# EAGLE design siedle-switch (EAGLE 6.5.0)
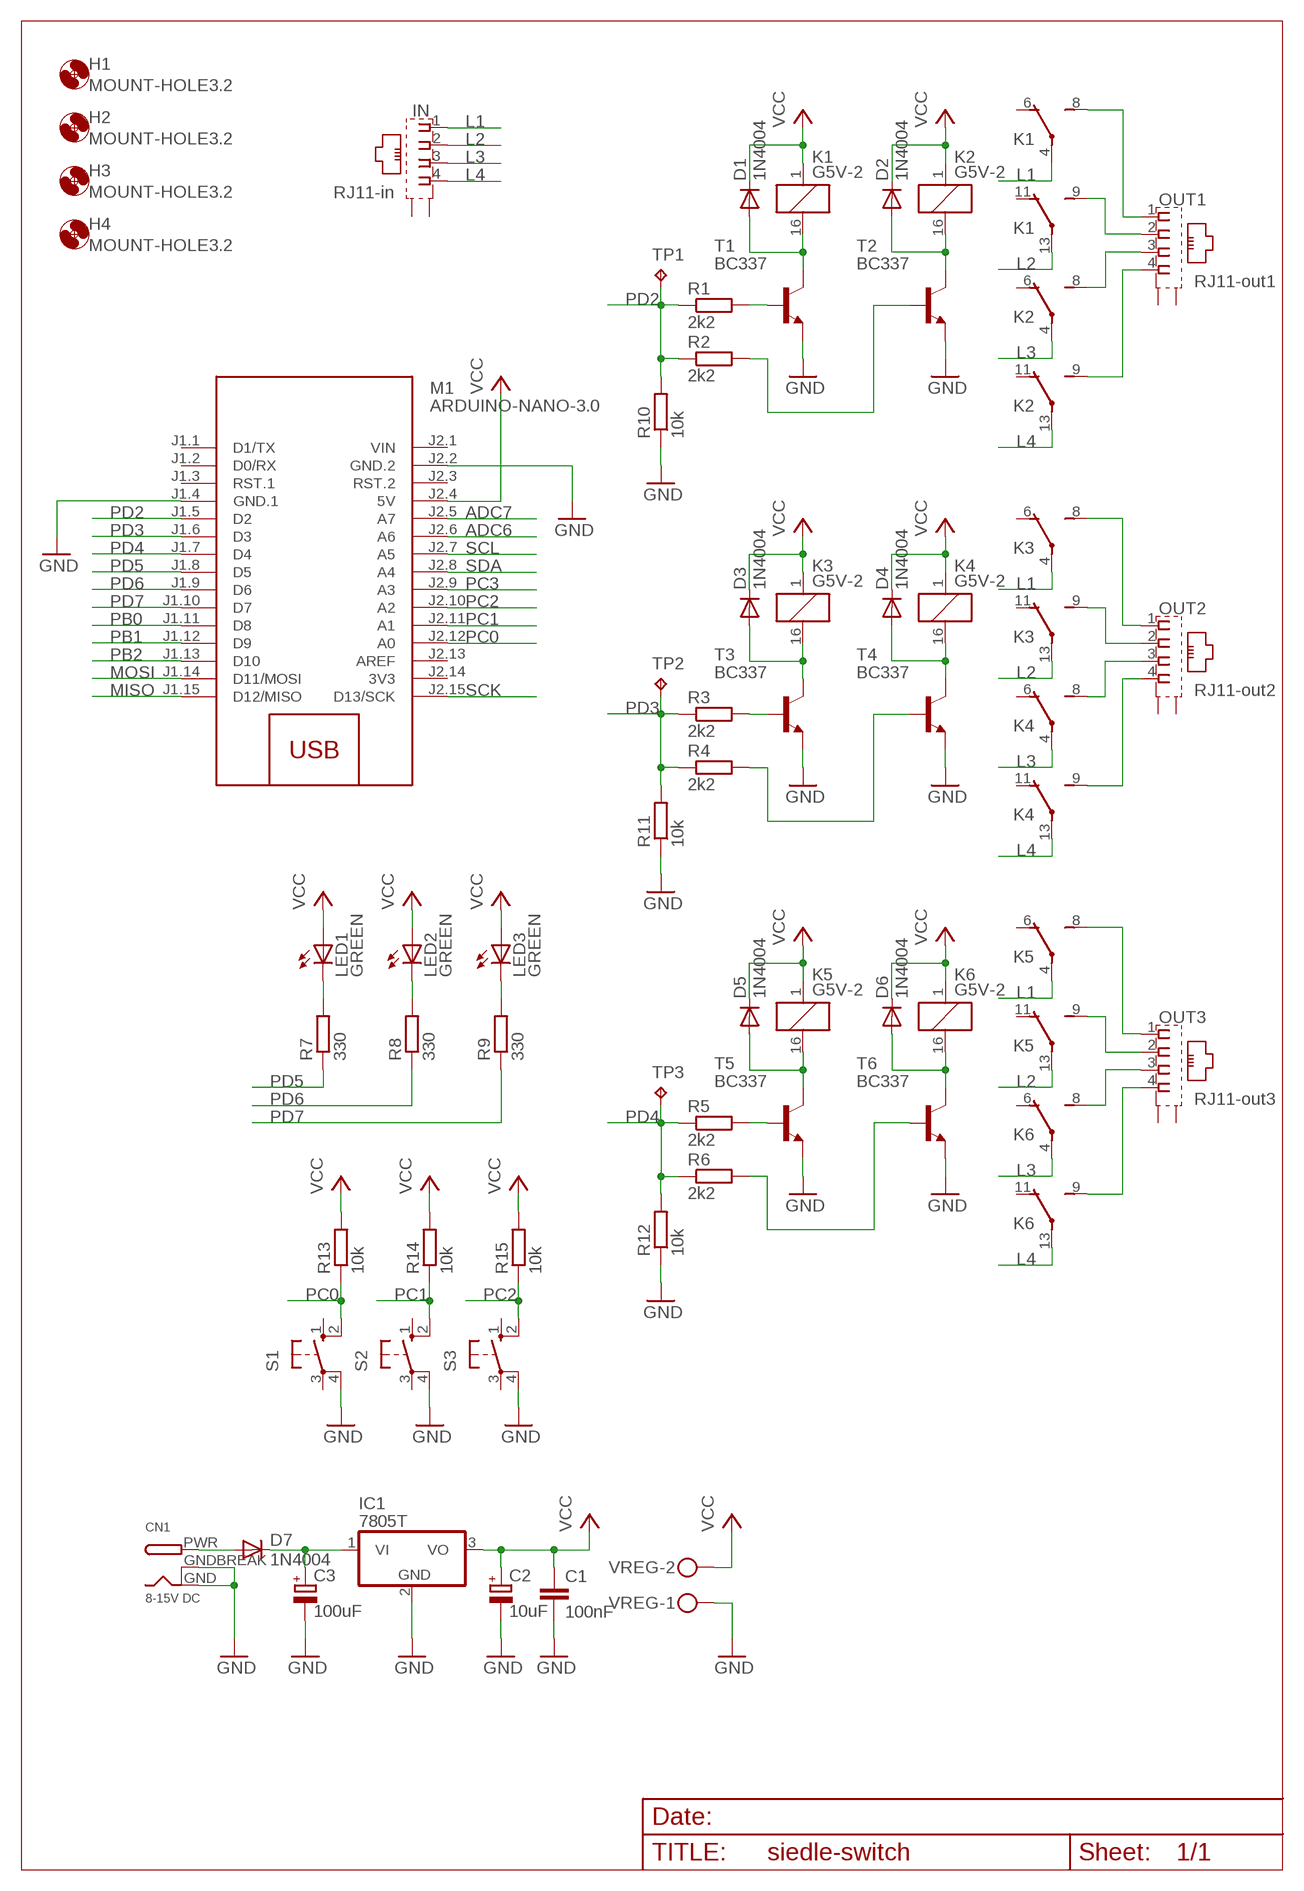
[diagram p0: schematic, sheet 1]

## Parts
C1  100nF  C-EUC1206  [C1206]
C2  10uF  CPOL-EUE2.5-5  [E2,5-5]
C3  100uF  CPOL-EUE3.5-8  [E3,5-8]
CN1  8-15V DC  DCBARRELPTH  [DCJACK_2MM_PTH]
D1  1N4004  [DO41-10]
D2  1N4004  [DO41-10]
D3  1N4004  [DO41-10]
D4  1N4004  [DO41-10]
D5  1N4004  [DO41-10]
D6  1N4004  [DO41-10]
D7  1N4004  [DO41-10]
H1  MOUNT-HOLE3.2  [3,2]
H2  MOUNT-HOLE3.2  [3,2]
H3  MOUNT-HOLE3.2  [3,2]
H4  MOUNT-HOLE3.2  [3,2]
IC1  7805T  [TO220H]
IN  RJ11-in  XRJK-S-01-6-4-0-9M2  [XRJK-S-01-6-4-0-9M2]
K1  G5V-2  [G5V-2]
K2  G5V-2  [G5V-2]
K3  G5V-2  [G5V-2]
K4  G5V-2  [G5V-2]
K5  G5V-2  [G5V-2]
K6  G5V-2  [G5V-2]
LED1  GREEN  LED3MM  [LED3MM]
LED2  GREEN  LED3MM  [LED3MM]
LED3  GREEN  LED3MM  [LED3MM]
M1  ARDUINO-NANO-3.0  [ARDUINO-NANO-3.0]
OUT1  RJ11-out1  XRJK-S-01-6-4-0-9M2  [XRJK-S-01-6-4-0-9M2]
OUT2  RJ11-out2  XRJK-S-01-6-4-0-9M2  [XRJK-S-01-6-4-0-9M2]
OUT3  RJ11-out3  XRJK-S-01-6-4-0-9M2  [XRJK-S-01-6-4-0-9M2]
R1  2k2  R-EU_0309/10  [0309/10]
R2  2k2  R-EU_0309/10  [0309/10]
R3  2k2  R-EU_0309/10  [0309/10]
R4  2k2  R-EU_0309/10  [0309/10]
R5  2k2  R-EU_0309/10  [0309/10]
R6  2k2  R-EU_0309/10  [0309/10]
R7  330  R-EU_0309/10  [0309/10]
R8  330  R-EU_0309/10  [0309/10]
R9  330  R-EU_0309/10  [0309/10]
R10  10k  R-EU_0309/10  [0309/10]
R11  10k  R-EU_0309/10  [0309/10]
R12  10k  R-EU_0309/10  [0309/10]
R13  10k  R-EU_0309/10  [0309/10]
R14  10k  R-EU_0309/10  [0309/10]
R15  10k  R-EU_0309/10  [0309/10]
S1  10-XX  [B3F-10XX]
S2  10-XX  [B3F-10XX]
S3  10-XX  [B3F-10XX]
T1  BC337  [TO92]
T2  BC337  [TO92]
T3  BC337  [TO92]
T4  BC337  [TO92]
T5  BC337  [TO92]
T6  BC337  [TO92]
TP1  TPPAD1-13  [P1-13]
TP2  TPPAD1-13  [P1-13]
TP3  TPPAD1-13  [P1-13]
VREG  MKDSN1,5/2-5,08  [MKDSN1,5/2-5,08]

## Nets
ADC6: M1.J2.6(A6)
ADC7: M1.J2.5(A7)
GND: C1.2 C2.- C3.- CN1.GND CN1.GNDBREAK IC1.2(GND) M1.J1.4(GND.1) M1.J2.2(GND.2) R10.1 R11.1 R12.1 S1.4(P1) S2.4(P1) S3.4(P1) T1.1(E) T2.1(E) T3.1(E) T4.1(E) T5.1(E) T6.1(E) VREG.1
L1: IN.1 K1.4(1:P) K3.4(1:P) K5.4(1:P)
L2: IN.2 K1.13(2:P) K3.13(2:P) K5.13(2:P)
L3: IN.3 K2.4(1:P) K4.4(1:P) K6.4(1:P)
L4: IN.4 K2.13(2:P) K4.13(2:P) K6.13(2:P)
MISO: M1.J1.15(D12/MISO)
MOSI: M1.J1.14(D11/MOSI)
N$1: D6.A K6.16 T6.3(C)
N$2: D5.A K5.16 T5.3(C)
N$3: R5.2 T5.2(B)
N$4: R6.2 T6.2(B)
N$5: K1.9(2:S) OUT1.2
N$6: K1.8(1:S) OUT1.1
N$7: K2.8(1:S) OUT1.3
N$8: K2.9(2:S) OUT1.4
N$9: D1.A K1.16 T1.3(C)
N$10: R1.2 T1.2(B)
N$11: LED3.K(C) R9.2
N$12: D2.A K2.16 T2.3(C)
N$13: R2.2 T2.2(B)
N$14: K3.9(2:S) OUT2.2
N$15: K4.8(1:S) OUT2.3
N$16: K4.9(2:S) OUT2.4
N$17: K3.8(1:S) OUT2.1
N$18: K5.9(2:S) OUT3.2
N$19: K6.8(1:S) OUT3.3
N$20: K6.9(2:S) OUT3.4
N$21: K5.8(1:S) OUT3.1
N$22: R3.2 T3.2(B)
N$23: D3.A K3.16 T3.3(C)
N$24: D4.A K4.16 T4.3(C)
N$25: LED2.K(C) R8.2
N$26: LED1.K(C) R7.2
N$27: R4.2 T4.2(B)
N$28: CN1.PWR D7.A
N$29: C3.+ D7.C IC1.1(VI)
PB0: M1.J1.11(D8)
PB1: M1.J1.12(D9)
PB2: M1.J1.13(D10)
PC0: M1.J2.12(A0) R13.1 S1.2(S1)
PC1: M1.J2.11(A1) R14.1 S2.2(S1)
PC2: M1.J2.10(A2) R15.1 S3.2(S1)
PC3: M1.J2.9(A3)
PD2: M1.J1.5(D2) R1.1 R2.1 R10.2 TP1.TP
PD3: M1.J1.6(D3) R3.1 R4.1 R11.2 TP2.TP
PD4: M1.J1.7(D4) R5.1 R6.1 R12.2 TP3.TP
PD5: M1.J1.8(D5) R7.1
PD6: M1.J1.9(D6) R8.1
PD7: M1.J1.10(D7) R9.1
SCK: M1.J2.15(D13/SCK)
SCL: M1.J2.7(A5)
SDA: M1.J2.8(A4)
VCC: C1.1 C2.+ D1.C D2.C D3.C D4.C D5.C D6.C IC1.3(VO) K1.1 K2.1 K3.1 K4.1 K5.1 K6.1 LED1.A LED2.A LED3.A M1.J2.4(5V) R13.2 R14.2 R15.2 VREG.2
Unconnected: IN.S1(S) IN.S2(S) K1.6(1:O) K1.11(2:O) K2.6(1:O) K2.11(2:O) K3.6(1:O) K3.11(2:O) K4.6(1:O) K4.11(2:O) K5.6(1:O) K5.11(2:O) K6.6(1:O) K6.11(2:O) M1.J1.1(D1/TX) M1.J1.2(D0/RX) M1.J1.3(RST.1) M1.J2.3(RST.2) M1.J2.13(AREF) OUT1.S1(S) OUT1.S2(S) OUT2.S1(S) OUT2.S2(S) OUT3.S1(S) OUT3.S2(S) S1.1(S) S1.3(P) S2.1(S) S2.3(P) S3.1(S) S3.3(P)

## Power pins joined to a net without a drawn wire
3V3: M1.J2.14(3V3)
VIN: M1.J2.1(VIN)

## Library data of the parts
C1 = rcl:C-EU: CAPACITOR, European symbol
C2 C3 = rcl:CPOL-EU: POLARIZED CAPACITOR, European symbol
CN1 = adafruit:DCBARREL: 2.0mm DC Barrel Jack DCJACK_2MM_PTH - Through Hole Jack (4UConnector: 05537)
D1-D7 = diode:1N4004: DIODE general purpose rectifier, 1 A
H1-H4 = holes:MOUNT-HOLE: MOUNTING HOLE with drill center marker
IC1 = linear:78*: Positive VOLTAGE REGULATOR Source: http://cache.national.com/ds/LM/LM78L05.pdf http://www.fairchildsemi.com/ds/LM/LM7805.pdf
IN OUT1-OUT3 = con-xmultiple:XRJK*4: RJ11 Connector without LED, 6 position, 4 contacts, thrue hole Source: XRJK-S-01-6-4-0-9M2(01).pdf
K1-K6 = relay:G5V-2: OMRON PCB Relay Source: http://www.omron.com/ecb/products/pdf/en-g5v2.pdf; MPN: G5V-2 5DC; OC_FARNELL: 9949488; OC_NEWARK: 78K5703
LED1-LED3 = led:LED: LED OSRAM: - CHIPLED LG R971, LG N971, LY N971, LG Q971, LY Q971, LO R971, LY R971 LH N974, LH R974 LS Q976, LO Q976, LY Q976 LO Q996 - Hyper CHIPLED LW Q18S LB Q993, LB Q99A, LB R99A - SideLED LS A670, LO A670, LY A670, LG A670, LP A670 LB A673, LV A673, LT A673, LW A673 LH A674 LY A675 LS A676, LA A676, LO A676, LY A676, LW A676 LS A679, LY A679, LG A679 - Hyper Micro SIDELED® LS Y876, LA Y876, LO Y876, LY Y876 LT Y87S - SmartLED LW L88C, LW L88S LB L89C, LB L89S, LG L890 LS L89K, LO L89K, LY L89K LS L896, LA L896, LO L896, LY L896 - TOPLED LS T670, LO T670, LY T670, LG T670, LP T670 LSG T670, LSP T670, LSY T670, LOP T670, LYG T670 LG T671, LOG T671, LSG T671 LB T673, LV T673, LT T673, LW T673 LH T674 LS T676, LA T676, LO T676, LY T676, LB T676, LH T676, LSB T676, LW T676 LB T67C, LV T67C, LT T67C, LS T67K, LO T67K, LY T67K, LW E67C LS E67B, LA E67B, LO E67B, LY E67B, LB E67C, LV E67C, LT E67C LW T67C LS T679, LY T679, LG T679 LS T770, LO T770, LY T770, LG T770, LP T770 LB T773, LV T773, LT T773, LW T773 LH T774 LS E675, LA E675, LY E675, LS T675 LS T776, LA T776, LO T776, LY T776, LB T776 LHGB T686 LT T68C, LB T68C - Hyper Mini TOPLED® LB M676 - Mini TOPLED Santana® LG M470 LS M47K, LO M47K, LY M47K Source: http://www.osram.convergy.de LUXEON: - LUMILED® LXK2-PW12-R00, LXK2-PW12-S00, LXK2-PW14-U00, LXK2-PW14-V00 LXK2-PM12-R00, LXK2-PM12-S00, LXK2-PM14-U00 LXK2-PE12-Q00, LXK2-PE12-R00, LXK2-PE12-S00, LXK2-PE14-T00, LXK2-PE14-U00 LXK2-PB12-K00, LXK2-PB12-L00, LXK2-PB12-M00, LXK2-PB14-N00, LXK2-PB14-P00, LXK2-PB14-Q00 LXK2-PR12-L00, LXK2-PR12-M00, LXK2-PR14-Q00, LXK2-PR14-R00 LXK2-PD12-Q00, LXK2-PD12-R00, LXK2-PD12-S00 LXK2-PH12-R00, LXK2-PH12-S00 LXK2-PL12-P00, LXK2-PL12-Q00, LXK2-PL12-R00 Source: www.luxeon.com KINGBRIGHT: KA-3528ASYC Source: www.kingbright.com
M1 = diy-modules:ARDUINO-NANO-3.0: Arduino Nano 3.0 and compatible devices More details available here: https://www.arduino.cc/en/Main/ArduinoBoardNano Click here to find device on ebay.com <http://www.ebay.com/sch/arduino+nano>
R1-R15 = rcl:R-EU_: RESISTOR, European symbol
S1-S3 = switch-omron:10-XX: OMRON SWITCH; MPN: B3F-1000; OC_FARNELL: 176432; OC_NEWARK: 36M3542
T1-T6 = transistor:BC337: NPN TRANSISTOR
TP1-TP3 = testpad:TP: Test pad
VREG = con-phoenix-508:MKDSN1,5/2-5,08: MKDSN 1,5/ 2-5,08 Printklemme Nennstrom: 13,5 A Nennspannung: 250 V Rastermaß: 5,08 mm Polzahl: 2 Anschlussart: Schraubanschluss Montage: Löten Anschlussrichtung Leiter/Platine: 0 ° Artikelnummer: 1729128 Source: http://eshop.phoenixcontact.com .. 1729128.pdf; MPN: MKDSN 1,5/2-5.08; OC_FARNELL: 1792903; OC_NEWARK: 30M2397

## Board
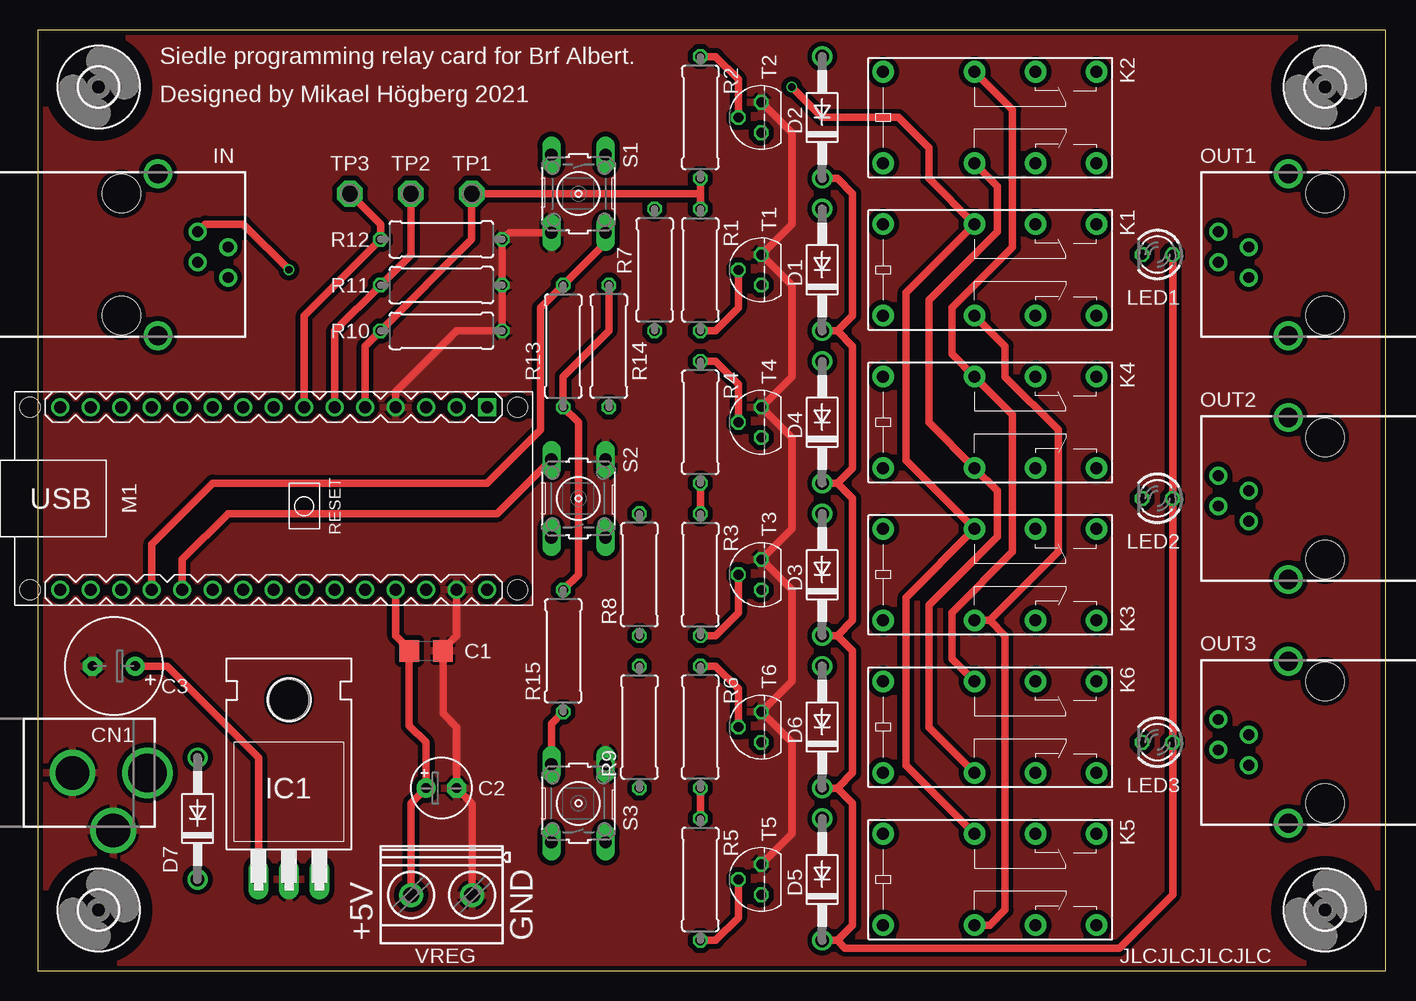
[diagram p1: board, top side]
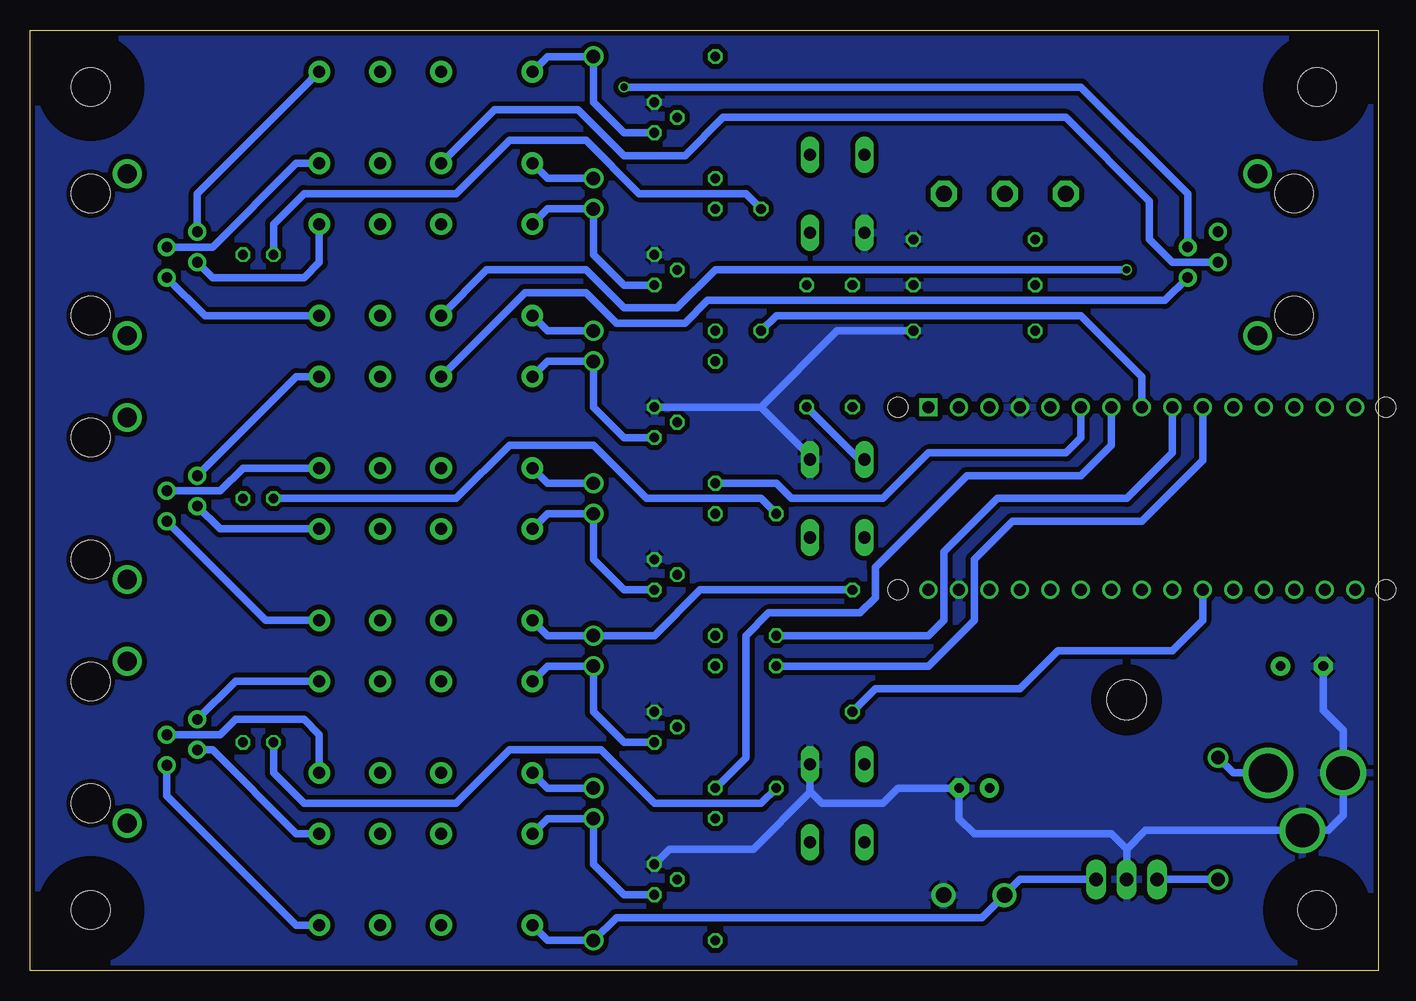
[diagram p2: board, bottom side, seen from below]

Size 112.38 x 78.41 mm. Coordinates in mm from the lower left corner, seen from the top.
Outline: 0,0 112.38,0 112.38,78.41 0,78.41 0,0
Copper layers (1*2*15*16): Top 0.035559375mm / dielectric 0.17018125mm / Route2 0.01778125mm / dielectric 47mil / Route15 0.01778125mm / dielectric 0.17018125mm / Bottom 0.035559375mm
Design rules "jlcpcb-4-layer": minimum track width 5mil, minimum drill 0.2mm, track to track 0.126490625mm, track to pad 0.126490625mm, pad to pad 0.126490625mm, via to via 0.126490625mm, smd to smd 0mil, copper to edge 0.1mm, drill to drill 5mil, minimum pad ring 4mil, minimum via ring 4mil, stop-mask expansion 3mil, vias tented up to drill 100mil, thermal gap 10mil

### Footprints (pad centres in the part's own frame; a part is rotated, then mirrored left to right if it is on the bottom)
C1206 = smd 1.6 x 1.8: 1 -1.4,0; 2 1.4,0
E2,5-5 = drill 0.813 pad 1.6: + -1.27,0 | drill 0.813 pad 1.6 octagon: - 1.27,0
E3,5-8 = drill 0.813 pad 1.6: + -1.778,0 | drill 0.813 pad 1.6 octagon: - 1.778,0
DCJACK_2MM_PTH = drill 2.8: GND 0,7.35; GNDBREAK 4.8,10.75 | drill 3.2: PWR 0,13.6
DO41-10 = drill 1.118: A 5.08,0; C -5.08,0
3,2 = hole 3.2: 0,0
TO220H = drill 1.118 long: 1 -2.54,-10.16; 2 0,-10.16; 3 2.54,-10.16 | hole 3.302: 0,4.826
XRJK-S-01-6-4-0-9M2 = drill 0.9 pad 1.5: 1 -1.905,6.35; 2 -0.635,8.89; 3 0.635,6.35; 4 1.905,8.89 | drill 1.6 pad 2.184: S1 -6.75,3.05; S2 6.75,3.05 | hole 3.2: -5.08,0; 5.08,0
G5V-2 = drill 1 pad 1.8: 1 -8.89,-3.81; 4 -1.27,-3.81; 6 3.81,-3.81; 8 8.89,-3.81; 9 8.89,3.81; 11 3.81,3.81; 13 -1.27,3.81; 16 -8.89,3.81
LED3MM = drill 0.813 octagon: A -1.27,0; K 1.27,0
ARDUINO-NANO-3.0 = drill 1 square: J1.1 17.78,7.62 | drill 1: J1.2 15.24,7.62; J1.3 12.7,7.62; J1.4 10.16,7.62; J1.5 7.62,7.62; J1.6 5.08,7.62; J1.7 2.54,7.62; J1.8 0,7.62; J1.9 -2.54,7.62; J1.10 -5.08,7.62; J1.11 -7.62,7.62; J1.12 -10.16,7.62; J1.13 -12.7,7.62; J1.14 -15.24,7.62; J1.15 -17.78,7.62; J2.1 17.78,-7.62; J2.2 15.24,-7.62; J2.3 12.7,-7.62; J2.4 10.16,-7.62; J2.5 7.62,-7.62; J2.6 5.08,-7.62; J2.7 2.54,-7.62; J2.8 0,-7.62; J2.9 -2.54,-7.62; J2.10 -5.08,-7.62; J2.11 -7.62,-7.62; J2.12 -10.16,-7.62; J2.13 -12.7,-7.62; J2.14 -15.24,-7.62; J2.15 -17.78,-7.62 | hole 1.651: -20.32,7.62; -20.32,-7.62; 20.32,-7.62; 20.32,7.62
0309/10 = drill 0.813 octagon: 1 -5.08,0; 2 5.08,0
B3F-10XX = drill 1.016 long: 1 -3.251,2.261; 2 3.251,2.261; 3 -3.251,-2.261; 4 3.251,-2.261
TO92 = drill 0.813 octagon: 1 1.27,0; 2 0,1.905; 3 -1.27,0
P1-13 = drill 1.321 pad 2.159 octagon: TP 0,0
MKDSN1,5/2-5,08 = drill 1.3 pad 2: 1 -2.561,0.025; 2 2.519,0.025

### Placement (x,y rotation side)
C1  32.38,26.67 0 top
C2  33.66,15.24 0 top
C3  6.35,25.4 180 top
CN1  -4.45,16.51 270 top
D1  65.41,58.42 90 top
D2  65.41,71.12 90 top
D3  65.41,33.02 90 top
D4  65.41,45.72 90 top
D5  65.41,7.62 90 top
D6  65.41,20.32 90 top
D7  13.34,12.7 90 top
H1  5.08,73.66 0 top
H2  107.31,5.08 0 top
H3  107.31,73.66 0 top
H4  5.08,5.08 0 top
IC1  20.95,17.78 0 top
IN  6.98,59.69 270 top
K1  79.38,58.42 0 top
K2  79.38,71.12 0 top
K3  79.38,33.02 0 top
K4  79.38,45.72 0 top
K5  79.38,7.62 0 top
K6  79.38,20.32 0 top
LED1  93.34,59.69 180 top
LED2  93.34,39.37 180 top
LED3  93.34,19.05 180 top
M1  19.68,39.37 0 top
OUT1  107.31,59.69 90 top
OUT2  107.31,39.37 90 top
OUT3  107.31,19.05 90 top
R1  55.24,58.42 270 top
R2  55.24,71.12 90 top
R3  55.24,33.02 270 top
R4  55.24,45.72 90 top
R5  55.24,7.62 270 top
R6  55.24,20.32 90 top
R7  51.43,58.42 90 top
R8  50.16,33.02 90 top
R9  50.16,20.32 270 top
R10  33.66,53.34 180 top
R11  33.66,57.15 180 top
R12  33.66,60.96 180 top
R13  43.82,52.07 270 top
R14  47.62,52.07 90 top
R15  43.82,26.67 90 top
S1  45.09,64.77 270 top
S2  45.09,39.37 90 top
S3  45.09,13.97 90 top
T1  60.32,58.42 90 top
T2  60.32,71.12 90 top
T3  60.32,33.02 90 top
T4  60.32,45.72 90 top
T5  60.32,7.62 90 top
T6  60.32,20.32 90 top
TP1  36.2,64.77 0 top
TP2  31.12,64.77 0 top
TP3  26.03,64.77 0 top
VREG  33.66,6.35 180 top

### Tracks (layer width: path | path; a pad name or v marks a point on that pad's centre or on a via)
GND
  Top 0.61: T5.1 62.87,11.43 62.87,19.05 T6.1 62.87,24.13 62.87,31.75 T3.1 62.87,36.83 62.87,44.45 T4.1 62.87,49.53 62.87,57.15 T1.1 62.87,62.23 62.87,69.85 T2.1 | M1.J2.2 34.92,27.94 33.78,26.8 C1.2 33.78,21.46 34.92,20.32 C2.- 36.22,13.95 VREG.1 | S1.4 39.29,61.52 R12.1 R11.1 R10.1 34.92,53.34 29.84,48.26 M1.J1.4
  Bottom 0.61: C3.- 4.57,21.72 2.9,20.05 CN1.GND 2.9,12.97 4.16,11.71 CN1.GNDBREAK 19.41,11.71 20.95,10.16 | 20.95,10.16 IC1.2 | 20.95,10.16 22.23,11.43 33.66,11.43 34.92,12.7 C2.- 40,15.24 41.27,13.97 46.35,13.97 47.35,14.96 S3.4 47.35,14.88 52.07,10.16 59.05,10.16 T5.1 | R10.1 45.09,53.34 51.43,46.99 | 51.43,46.99 T4.1 | S2.4 47.35,42.9 51.43,46.99
  pour Bottom (isolate 0.406): 0,78.1 0,0 112.4,0 112.4,78.1
  pour Top (isolate 0.406): 0,78.1 112.4,78.1 112.4,0 0,0
L1  (via drill 0.6)
  Top 0.61: K5.4 79.38,3.81 80.65,5.08 80.65,27.94 79.38,29.21 | K3.4 79.38,29.21 | 79.38,29.21 85.09,34.92 85.09,45.08 80.65,49.53 80.65,52.07 K1.4 | IN.1 13.97,62.23 17.14,62.23 v20.95,58.42
  Bottom 0.61: K1.4 74.29,58.42 66.04,58.42 62.87,55.24 58.42,55.24 55.24,58.42 v20.95,58.42
L2  (via drill 0.6)
  Top 0.61: K5.13 72.39,17.14 72.39,31.11 K3.13 72.39,42.55 72.39,56.52 K1.13 74.29,66.04 74.29,68.58 71.75,71.12 65.41,71.12 v62.87,73.66
  Bottom 0.61: IN.2 15.88,64.77 24.77,73.66 v62.87,73.66
L3
  Top 0.61: K6.4 74.29,20.32 74.29,30.48 80.01,36.19 80.01,40 K4.4 74.29,45.72 74.29,55.88 80.01,61.59 80.01,65.41 K2.4
  Bottom 0.61: K2.4 73.66,71.75 66.68,71.75 62.87,67.94 57.79,67.94 54.61,71.12 26.03,71.12 19.05,64.13 19.05,60.96 17.14,59.05 IN.3
L4
  Top 0.61: K6.13 76.2,26.04 76.2,29.85 81.28,34.92 81.28,46.35 K4.13 76.2,51.44 76.2,55.24 81.28,60.33 81.28,71.75 K2.13
  Bottom 0.61: IN.4 17.78,55.88 55.88,55.88 57.79,53.97 63.5,53.97 66.04,56.52 71.12,56.52 K4.13
N$1
  Bottom 0.61: K6.16 69.22,25.4 D6.A 65.41,21.59 62.87,19.05 T6.3
N$2
  Bottom 0.61: K5.16 69.22,12.7 D5.A 65.41,8.89 62.87,6.35 T5.3
N$3
  Top 0.61: R5.2 56.51,2.54 58.42,4.45 T5.2
N$4
  Top 0.61: R6.2 56.51,25.4 58.42,23.5 T6.2
N$5
  Bottom 0.61: OUT1.2 97.16,57.78 89.53,57.78 88.26,59.05 K1.9
N$6
  Bottom 0.61: K1.8 97.79,54.61 OUT1.1
N$7
  Bottom 0.61: OUT1.3 97.16,60.33 90.17,67.31 K2.8
N$8
  Bottom 0.61: OUT1.4 98.43,64.77 K2.9
N$9
  Bottom 0.61: K1.16 69.22,63.5 D1.A 65.41,59.69 62.87,57.15 T1.3
N$10
  Top 0.61: R1.2 56.51,53.34 58.42,55.24 T1.2
N$11
  Bottom 0.61: R9.2 51.43,13.97 60.32,13.97 64.77,18.42 72.39,18.42 76.84,13.97 89.53,13.97 92.07,16.51 LED3.K
N$12
  Bottom 0.61: K2.16 69.22,76.2 D2.A 65.41,72.39 62.87,69.85 T2.3
N$13
  Top 0.61: R2.2 56.51,76.2 58.42,74.3 T2.2
N$14
  Bottom 0.61: K3.9 96.52,36.83 OUT2.2
N$15
  Bottom 0.61: K4.8 94.62,41.91 96.52,40 OUT2.3
N$16
  Bottom 0.61: OUT2.4 90.17,49.53 K4.9
N$17
  Bottom 0.61: K3.8 92.71,29.21 OUT2.1
N$18
  Bottom 0.61: OUT3.2 97.16,18.42 90.17,11.43 K5.9
N$19
  Bottom 0.61: OUT3.3 96.52,19.68 95.25,20.96 89.53,20.96 88.26,19.68 K6.8
N$20
  Bottom 0.61: K6.9 95.25,24.13 OUT3.4
N$21
  Bottom 0.61: OUT3.1 100.97,14.61 90.17,3.81 K5.8
N$22
  Top 0.61: R3.2 56.51,27.94 58.42,29.85 T3.2
N$23
  Bottom 0.61: K3.16 69.22,38.1 D3.A 65.41,34.29 62.87,31.75 T3.3
N$24
  Bottom 0.61: K4.16 69.22,50.8 D4.A 65.41,46.99 62.87,44.45 T4.3
N$25
  Bottom 0.61: LED2.K 76.84,39.37 72.39,43.81 65.41,43.81 60.96,39.37 51.43,39.37 R8.2
N$26
  Bottom 0.61: R7.2 52.71,64.77 61.59,64.77 66.04,69.22 72.39,69.22 76.84,64.77 89.53,64.77 92.07,62.23 LED1.K
N$27
  Top 0.61: R4.2 56.51,50.8 58.42,48.89 T4.2
N$28
  Bottom 0.61: CN1.PWR 12.06,16.51 D7.A
N$29
  Top 0.61: IC1.1 18.41,17.78 10.8,25.4 C3.+
  Bottom 0.61: IC1.1 D7.C
PC0
  Top 0.61: S1.2 47.35,60.68 R13.1 41.91,55.24 41.91,45.08 37.46,40.64 14.6,40.64 9.52,35.56 M1.J2.12
PC1
  Top 0.61: M1.J2.11 12.06,34.29 15.88,38.1 38.3,38.1 S2.2
  Bottom 0.61: S2.2 43.26,42.62 R14.1
PC2
  Top 0.61: S3.2 42.82,20.6 R15.1
  Bottom 0.61: M1.J2.10 14.6,29.21 17.14,26.67 26.67,26.67 29.84,23.5 41.91,23.5 R15.1
PD2
  Top 0.61: R1.1 55.24,64.77 | 55.24,64.77 R2.1 | M1.J1.5 27.3,52.07 R10.2 36.2,60.96 TP1.TP 55.24,64.77
PD3
  Top 0.61: R3.1 R4.1 | M1.J1.6 24.77,53.34 R11.2 31.12,59.69 TP2.TP
  Bottom 0.61: M1.J1.6 24.77,44.45 26.03,43.18 37.46,43.18 41.27,39.37 48.9,39.37 50.16,40.64 R4.1
PD4
  Top 0.61: R5.1 R6.1 | M1.J1.7 22.23,54.61 R12.2 28.57,62.23 TP3.TP
  Bottom 0.61: M1.J1.7 22.23,43.81 24.77,41.28 34.29,41.28 41.91,33.66 41.91,31.11 43.18,29.85 50.8,29.85 52.71,27.94 52.71,17.78 R6.1
PD5
  Bottom 0.61: M1.J1.8 19.68,49.53 24.77,54.61 50.16,54.61 R7.1
PD6
  Bottom 0.61: M1.J1.9 17.14,43.18 20.95,39.37 31.75,39.37 36.2,34.92 36.2,29.21 37.46,27.94 R8.1
PD7
  Bottom 0.61: M1.J1.10 14.6,42.55 19.68,37.47 30.48,37.47 33.66,34.29 33.66,29.21 37.46,25.4 R9.1
VCC
  Top 0.61: LED1.A LED2.A LED3.A 94.62,6.35 90.17,1.91 67.31,1.91 66.68,2.54 | D2.C 66.68,66.04 67.94,64.77 67.94,54.61 66.68,53.34 | 66.68,53.34 D1.C | 66.68,53.34 67.94,52.07 67.94,41.91 66.68,40.64 | 66.68,40.64 D4.C | 66.68,40.64 67.94,39.37 67.94,29.21 66.68,27.94 | 66.68,27.94 D3.C | 66.68,27.94 67.94,26.67 67.94,16.51 66.68,15.24 | 66.68,15.24 D6.C | 66.68,15.24 67.94,13.97 67.94,3.81 66.68,2.54 | 66.68,2.54 D5.C | M1.J2.4 29.84,27.94 30.98,26.8 C1.1 30.98,20.45 32.38,19.05 C2.+ 31.14,13.99 VREG.2 | R14.2 47.62,53.34 43.82,49.53 R13.2 45.09,45.72 45.09,33.02 R15.2
  Bottom 0.61: D2.C 69.22,66.04 K2.1 | D1.C 69.22,53.34 K1.1 | D4.C 69.22,40.64 K4.1 | K3.1 69.22,27.94 D3.C 60.32,27.94 56.51,31.75 R15.2 | D6.C 69.22,15.24 K6.1 | K5.1 69.22,2.54 D5.C 63.5,4.45 33.02,4.45 VREG.2 | VREG.2 | VREG.2 29.84,7.62 IC1.3

### Text on the board
tNames: Siedle programming relay card for Brf Albert. | Designed by Mikael Högberg 2021 | +5V | GND | JLCJLCJLCJLC